# EAGLE design mainboard (EAGLE 7.2.0)
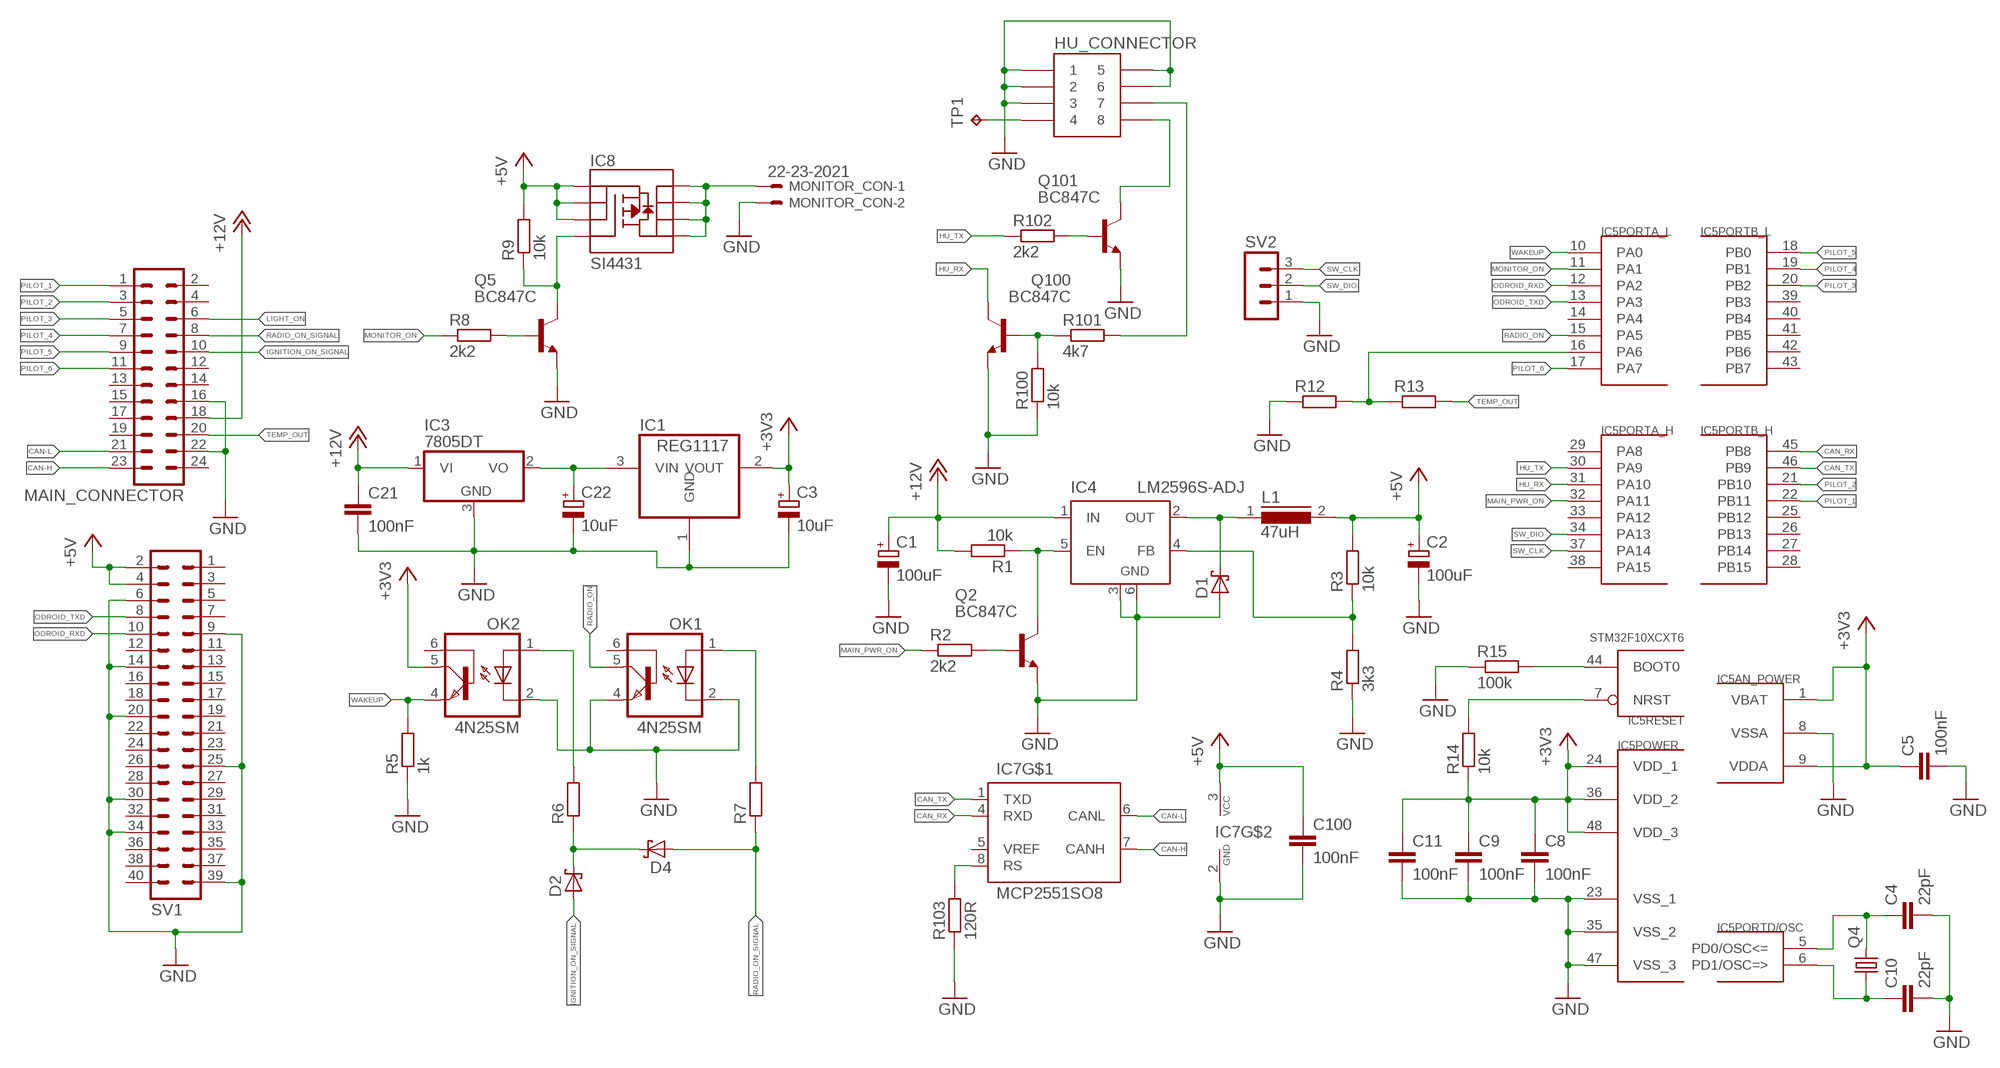
[diagram p0: schematic, sheet 1]

## Parts
C1  100uF  CPOL-EU153CLV-0807  [153CLV-0807]
C2  100uF  CPOL-EU153CLV-0807  [153CLV-0807]
C3  10uF  CPOL-EUSMCA  [SMC_A]
C4  22pF  C-EUC0805  [C0805]
C5  100nF  C-EUC0603  [C0603]
C8  100nF  C-EUC0805  [C0805]
C9  100nF  C-EUC0805  [C0805]
C10  22pF  C-EUC0805  [C0805]
C11  100nF  C-EUC0805  [C0805]
C21  100nF  C-EUC0805  [C0805]
C22  10uF  CPOL-EUSMCA  [SMC_A]
C100  100nF  C-EUC0805  [C0805]
D1  SCHOTTKY-DIODESMD  [SMB]
D2  SCHOTTKY-DIODESMD  [SMB]
D4  SCHOTTKY-DIODESMD  [SMB]
HU_CONNECTOR  MRX56908CV  [MRX56908]
IC1  REG1117  [SOT223]
IC3  7805DT  [TO252]
IC4  LM2596S-ADJ  LM2596S  [TO263-5]
IC5  STM32F10XCXT6  [TQFP48]
IC7  MCP2551SO8  [SO08]
IC8  SI4431  MOSFET-PCHANNEL-SOIC8SOIC8  [SO08]
L1  47uH  DR125  [DR125]
MAIN_CONNECTOR  MA12-2  [MA12-2]
MONITOR_CON  22-23-2021  [22-23-2021]
OK1  4N25SM  [DIL6-SMD]
OK2  4N25SM  [DIL6-SMD]
Q2  BC847C  BC847C-NPN-SOT23-BEC  [SOT23-BEC]
Q4  CRYSTALHC49UP  [HC49UP]
Q5  BC847C  BC847C-NPN-SOT23-BEC  [SOT23-BEC]
Q100  BC847C  BC847C-NPN-SOT23-BEC  [SOT23-BEC]
Q101  BC847C  BC847C-NPN-SOT23-BEC  [SOT23-BEC]
R1  10k  R-EU_M0805  [M0805]
R2  2k2  R-EU_M0805  [M0805]
R3  10k  R-EU_M0805  [M0805]
R4  3k3  R-EU_M0805  [M0805]
R5  1k  R-EU_M0805  [M0805]
R6  R-EU_M0805  [M0805]
R7  R-EU_M0805  [M0805]
R8  2k2  R-EU_M0805  [M0805]
R9  10k  R-EU_M0805  [M0805]
R12  R-EU_M0805  [M0805]
R13  R-EU_M0805  [M0805]
R14  10k  R-EU_M0805  [M0805]
R15  100k  R-EU_M0805  [M0805]
R100  10k  R-EU_M0805  [M0805]
R101  4k7  R-EU_M0805  [M0805]
R102  2k2  R-EU_M0805  [M0805]
R103  120R  R-EU_R0805  [R0805]
SV1  MA20-2  [MA20-2]
SV2  MA03-1  [MA03-1]
TP1  TPPAD1-13  [P1-13]

## Nets
+3V3: C3.+ C5.1 C8.1 C9.1 C11.1 IC1.2(VOUT) IC5.1(AN_POWER:VBAT) IC5.9(AN_POWER:VDDA) IC5.24(POWER:VDD_1) IC5.36(POWER:VDD_2) IC5.48(POWER:VDD_3) OK2.5(COL) R14.1
+5V [zasilanie]: C2.+ C100.1 IC7.3(VCC) IC8.1(S) IC8.2(S) IC8.3(S) L1.2 R3.2 R9.2 SV1.2 SV1.4
+5V_CONST [zasilanie]: C22.+ IC1.3(VIN) IC3.2(VO)
+12V: C1.+ C21.1 IC3.1(VI) IC4.1(IN) MAIN_CONNECTOR.18 R1.2
CAN-H: IC7.7(CANH) MAIN_CONNECTOR.23
CAN-L: IC7.6(CANL) MAIN_CONNECTOR.21
CAN_RX: IC5.45(PORTB_H:PB8) IC7.4(RXD)
CAN_TX: IC5.46(PORTB_H:PB9) IC7.1(TXD)
GND: C1.- C2.- C3.- C4.2 C5.2 C8.2 C9.2 C10.2 C11.2 C21.2 C22.- C100.2 D1.A HU_CONNECTOR.P1 HU_CONNECTOR.P2 HU_CONNECTOR.P3 HU_CONNECTOR.P5 HU_CONNECTOR.P6 IC1.1(GND) IC3.3(GND) IC4.3(GND) IC4.6(GND) IC5.8(AN_POWER:VSSA) IC5.23(POWER:VSS_1) IC5.35(POWER:VSS_2) IC5.47(POWER:VSS_3) IC7.2(GND) MAIN_CONNECTOR.16 MAIN_CONNECTOR.22 MONITOR_CON.2 OK1.2(C) OK1.4(EMI) OK2.2(C) Q2.E Q5.E Q100.E Q101.E R4.1 R5.1 R12.1 R15.1 R100.1 R103.1 SV1.6 SV1.9 SV1.14 SV1.20 SV1.25 SV1.30 SV1.34 SV1.39 SV2.1
HU_RX: IC5.31(PORTA_H:PA10) Q100.C
HU_TX: IC5.30(PORTA_H:PA9) R102.1
IGNITION_ON_SIGNAL: D2.A MAIN_CONNECTOR.10
LIGHT_ON: MAIN_CONNECTOR.6
MAIN_PWR_ON: IC5.32(PORTA_H:PA11) R2.1
MONITOR_ON: IC5.11(PORTA_L:PA1) R8.1
N$1: IC7.8(RS) R103.2
N$2: IC5.16(PORTA_L:PA6) R12.2 R13.1
N$3: C4.1 IC5.5(PORTD/OSC:PD0/OSC<=) Q4.2
N$8: D1.C IC4.2(OUT) L1.1
N$9: IC4.5(EN) Q2.C R1.1
N$10: Q2.B R2.2
N$12: IC4.4(FB) R3.1 R4.2
N$13: IC5.7(RESET:NRST) R14.2
N$14: IC8.5(D) IC8.6(D) IC8.7(D) IC8.8(D) MONITOR_CON.1
N$18: C10.1 IC5.6(PORTD/OSC:PD1/OSC=>) Q4.1
N$23: Q101.B R102.2
N$24: OK2.1(A) R6.2
N$25: OK1.1(A) R7.2
N$26: D2.C D4.C R6.1
N$27: IC5.44(RESET:BOOT0) R15.2
N$32: HU_CONNECTOR.P7 R101.2
N$33: Q100.B R100.2 R101.1
N$34: HU_CONNECTOR.P8 Q101.C
N$53: Q5.B R8.2
N$67: IC8.4(G) Q5.C R9.1
ODROID_RXD: IC5.12(PORTA_L:PA2) SV1.10
ODROID_TXD: IC5.13(PORTA_L:PA3) SV1.8
PILOT_1: IC5.22(PORTB_H:PB11) MAIN_CONNECTOR.1
PILOT_2: IC5.21(PORTB_H:PB10) MAIN_CONNECTOR.3
PILOT_3: IC5.20(PORTB_L:PB2) MAIN_CONNECTOR.5
PILOT_4: IC5.19(PORTB_L:PB1) MAIN_CONNECTOR.7
PILOT_5: IC5.18(PORTB_L:PB0) MAIN_CONNECTOR.9
PILOT_6: IC5.17(PORTA_L:PA7) MAIN_CONNECTOR.11
RADIO_ON: IC5.15(PORTA_L:PA5) OK1.5(COL)
RADIO_ON_SIGNAL: D4.A MAIN_CONNECTOR.8 R7.1
SPDIF_IN: HU_CONNECTOR.P4 TP1.TP
SW_CLK: IC5.37(PORTA_H:PA14) SV2.3
SW_DIO: IC5.34(PORTA_H:PA13) SV2.2
TEMP_OUT: MAIN_CONNECTOR.20 R13.2
WAKEUP: IC5.10(PORTA_L:PA0) OK2.4(EMI) R5.2
Unconnected: IC5.2(PORTC:PC13) IC5.3(PORTC:PC14) IC5.4(PORTC:PC15) IC5.14(PORTA_L:PA4) IC5.25(PORTB_H:PB12) IC5.26(PORTB_H:PB13) IC5.27(PORTB_H:PB14) IC5.28(PORTB_H:PB15) IC5.29(PORTA_H:PA8) IC5.33(PORTA_H:PA12) IC5.38(PORTA_H:PA15) IC5.39(PORTB_L:PB3) IC5.40(PORTB_L:PB4) IC5.41(PORTB_L:PB5) IC5.42(PORTB_L:PB6) IC5.43(PORTB_L:PB7) IC7.5(VREF) MAIN_CONNECTOR.2 MAIN_CONNECTOR.4 MAIN_CONNECTOR.12 MAIN_CONNECTOR.13 MAIN_CONNECTOR.14 MAIN_CONNECTOR.15 MAIN_CONNECTOR.17 MAIN_CONNECTOR.19 MAIN_CONNECTOR.24 OK1.6(BAS) OK2.6(BAS) SV1.1 SV1.3 SV1.5 SV1.7 SV1.11 SV1.12 SV1.13 SV1.15 SV1.16 SV1.17 SV1.18 SV1.19 SV1.21 SV1.22 SV1.23 SV1.24 SV1.26 SV1.27 SV1.28 SV1.29 SV1.31 SV1.32 SV1.33 SV1.35 SV1.36 SV1.37 SV1.38 SV1.40

## Library data of the parts
C1-C3 C22 = resistor:CPOL-EU: POLARIZED CAPACITOR, European symbol
C4 C5 C8-C11 C21 C100 = rcl:C-EU: CAPACITOR, European symbol
D1 D2 D4 = diode:SCHOTTKY-DIODE: Schottky Diode
HU_CONNECTOR = moja:MRX56908CV
IC1 = burr-brown:REG1117: 800mA and 1A Low Dropout (LDO) Positive Regulator 1.8V, 2.5V, 2.85V, 3.3V, 5V, and Adj; MPN: REG1117; OC_FARNELL: 1097566; OC_NEWARK: 14P6981
IC3 = linear:78*: Positive VOLTAGE REGULATOR Source: http://cache.national.com/ds/LM/LM78L05.pdf http://www.fairchildsemi.com/ds/LM/LM7805.pdf
IC4 = linear:LM2596S: STEP-DOWN VOLTAGE REGULATOR
IC5 = stm32:STM32F10XCXT6: ST STM32F101/103 48pin LQFP
IC7 = can:MCP2551: CAN Tranceiver Microchip
IC8 = SparkFun:MOSFET-PCHANNEL-SOIC8
L1 = inductors:DR125: High Power Density, High Efficiency, Shielded Inductors Source: coiltronics_dr_series.pdf
MAIN_CONNECTOR = con-lstb:MA12-2: PIN HEADER
MONITOR_CON = con-molex:22-23-2021: .100" (2.54mm) Center Header - 2 Pin
OK1 OK2 = optocoupler:4N*?M: General Purpose 6-Pin Phototransistor Optocouplers Source: http://www.fairchildsemi.com/ds/4N/4N35-M.pdf
Q2 Q5 Q100 Q101 = transistor:*-NPN-: NPN Transistror BF959 corrected 2008.03.06
Q4 = crystal:CRYSTAL: CRYSTAL; OC_FARNELL: unknown; OC_NEWARK: unknown
R1-R9 R12-R15 R100-R102 = rcl:R-EU_: RESISTOR, European symbol
R103 = resistor:R-EU_: RESISTOR, European symbol
SV1 = con-lstb:MA20-2: PIN HEADER; OC_FARNELL: unknown; OC_NEWARK: unknown
SV2 = con-lstb:MA03-1: PIN HEADER; OC_FARNELL: unknown; OC_NEWARK: unknown
TP1 = testpad:TP: Test pad

## Net classes
1 zasilanie: clearance 1.5 mm

## Board
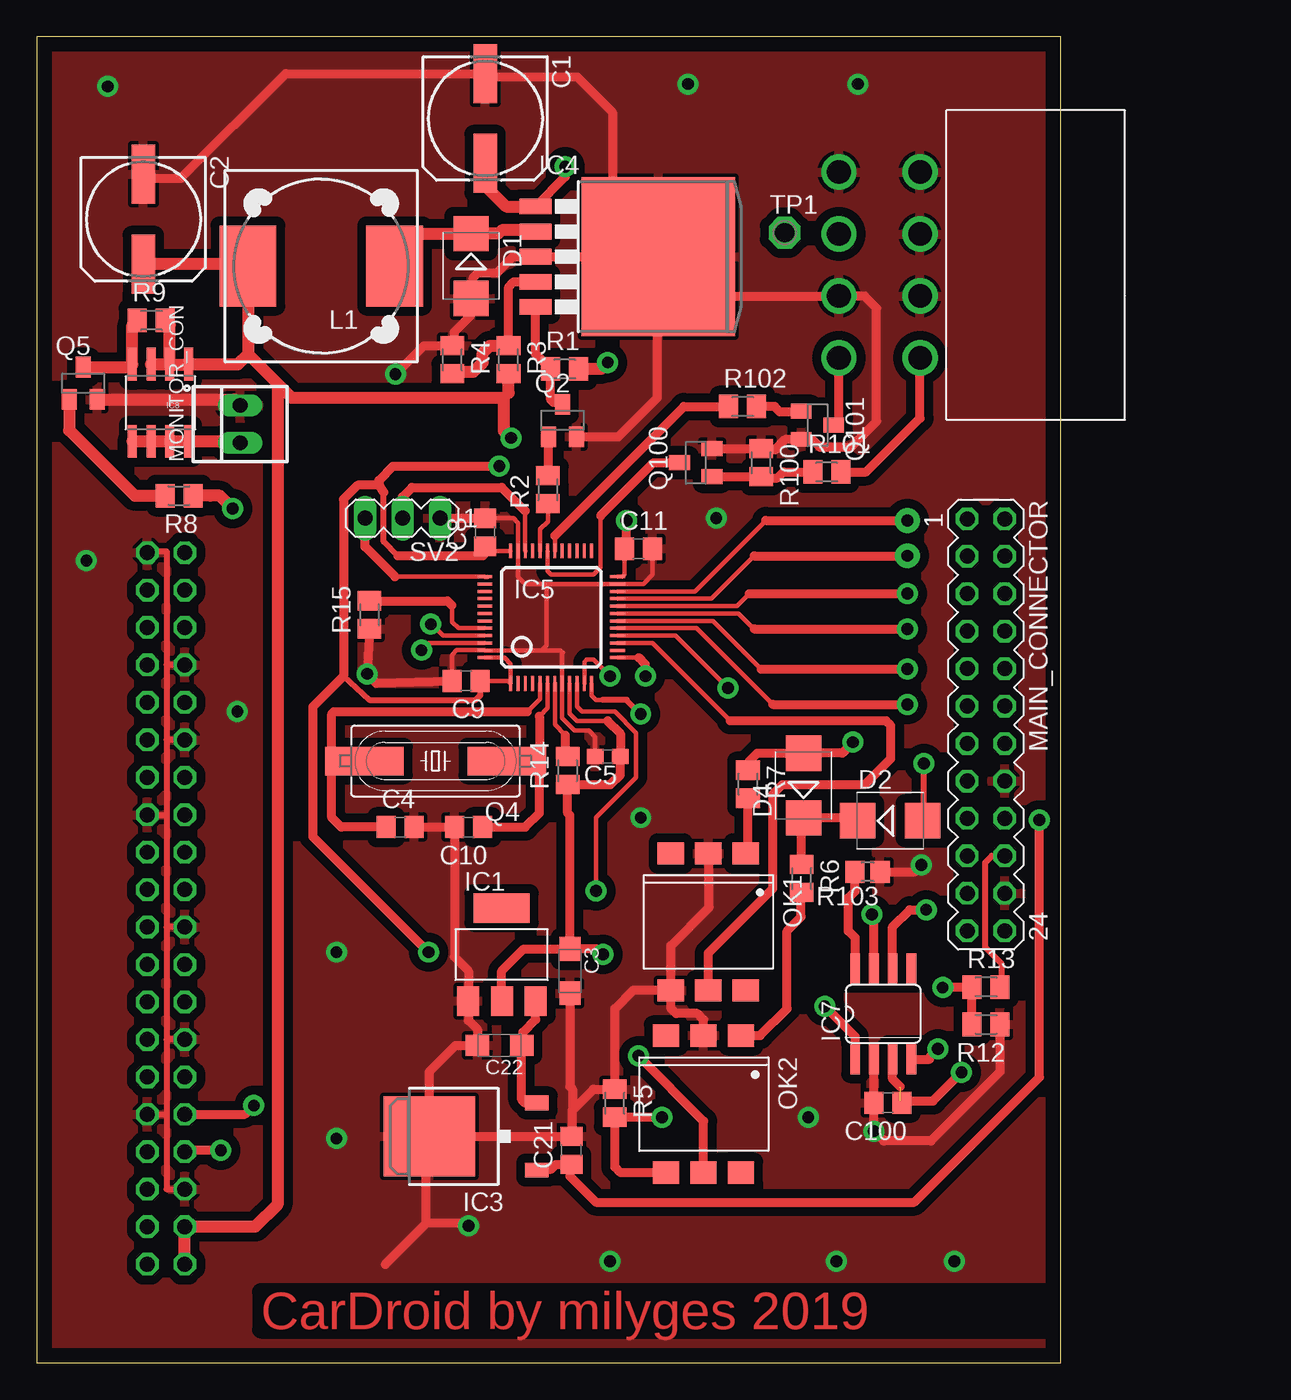
[diagram p1: board, top side]
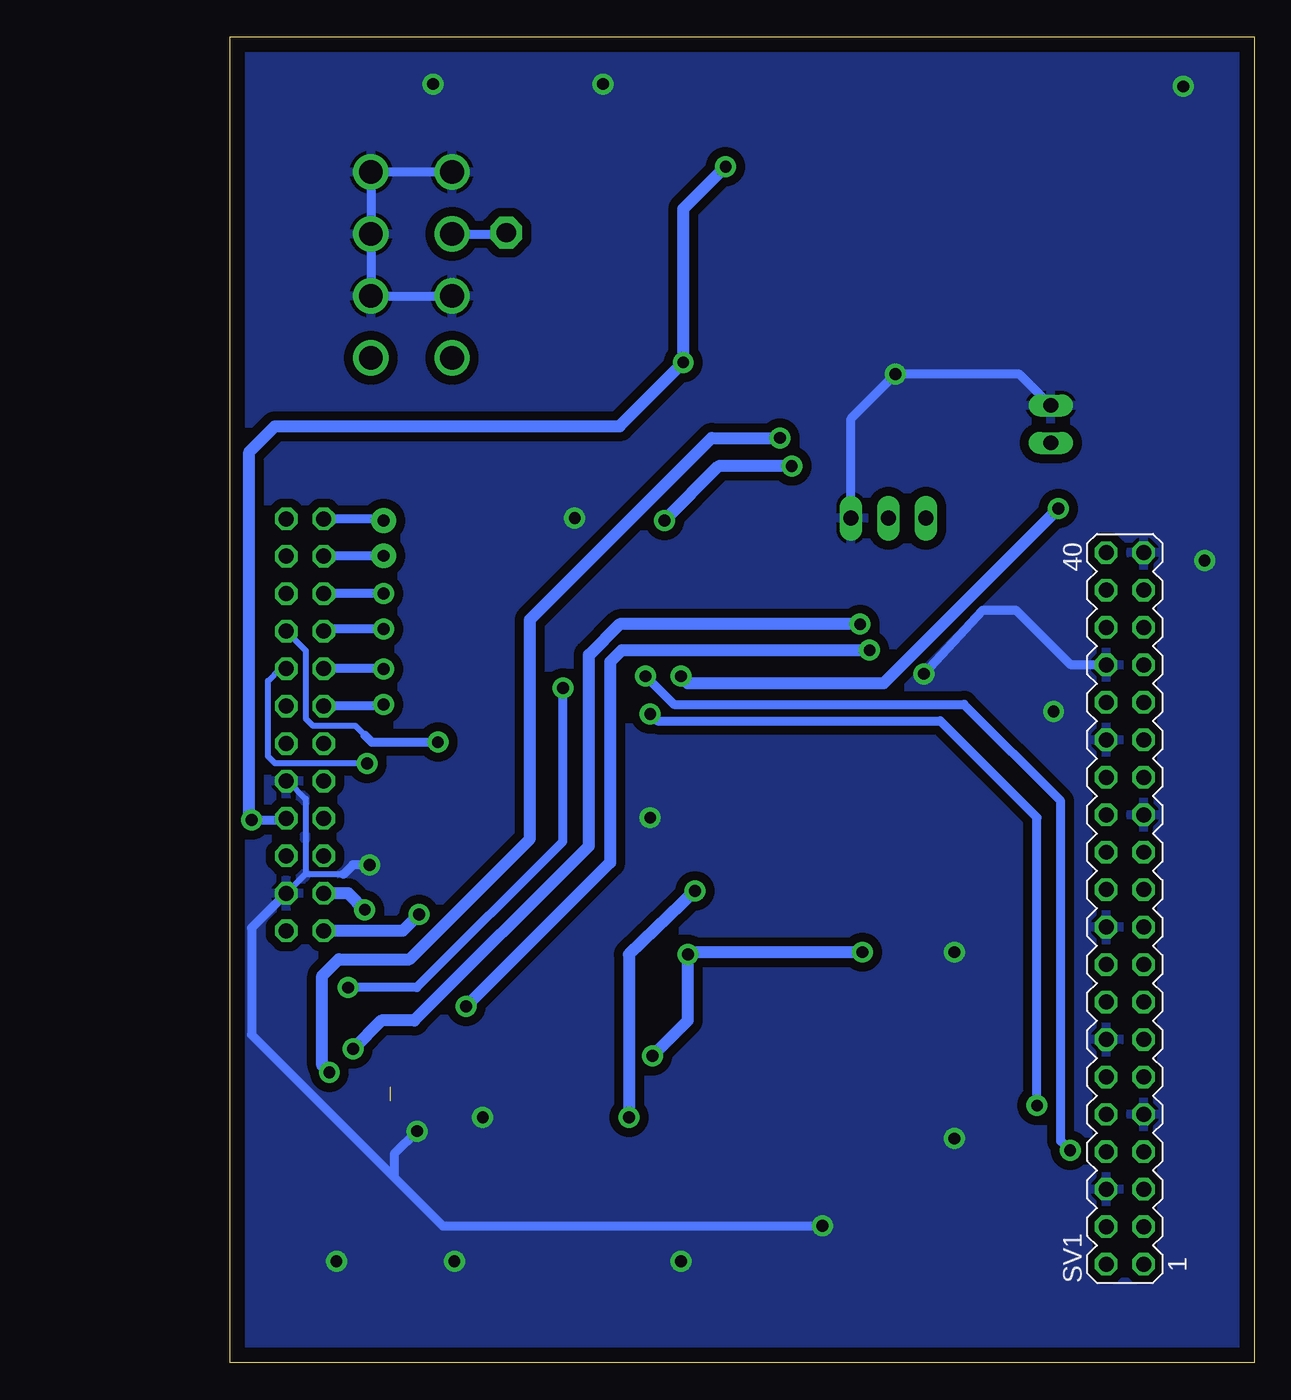
[diagram p2: board, bottom side, seen from below]

Size 69.44 x 89.92 mm. Coordinates in mm from the lower left corner, seen from the top.
Outline: 69.44,0 69.44,89.92 0,89.92 0,0 69.44,0
Copper layers (1*16): Top 0.035mm / dielectric 1.5mm / Bottom 0.035mm
Design rules "default": minimum track width 10mil, minimum drill 24mil, track to track 8mil, track to pad 8mil, pad to pad 8mil, via to via 8mil, smd to smd 8mil, copper to edge 40mil, drill to drill 8mil, minimum pad ring 10mil, minimum via ring 8mil, stop-mask expansion 4mil, vias tented up to drill 0mil, thermal gap 10mil

### Footprints (pad centres in the part's own frame; a part is rotated, then mirrored left to right if it is on the bottom)
153CLV-0807 = smd 4 x 1.6: + 3.05,0; - -3.05,0
SMC_A = smd 1.6 x 1.4: + -1.5,0; - 1.5,0
C0805 = smd 1.3 x 1.5: 1 -0.95,0; 2 0.95,0
C0603 = smd 1.1 x 1: 1 -0.85,0; 2 0.85,0
SMB = smd 2.4 x 2.4: A 2.2,0; C -2.2,0
MRX56908 = drill 1.6: P1 8.4,0; P2 8.4,5.5; P3 4.2,0; P4 4.2,5.5; P5 0,0; P6 0,5.5; P7 -4.2,0; P8 -4.2,5.5
SOT223 = smd 1.499 x 2.007: 1 -2.261,-3.15; 2 0.025,-3.15; 3 2.311,-3.15 | smd 3.81 x 2.007: 4 0,3.15
TO252 = smd 1 x 1.6: 1 -2.28,-4.8; 2 2.28,-4.8 | smd 5.4 x 6.2: 3 0,2.5
TO263-5 = smd 1.067 x 2.159: 1 -3.404,-5.791; 2 -1.702,-5.791; 3 0,-5.791; 4 1.702,-5.791; 5 3.404,-5.791 | smd 10.8 x 10.41: 6 0,2.54
TQFP48 = smd 0.2 x 1: 1 -2.75,-4.5; 2 -2.25,-4.5; 3 -1.75,-4.5; 4 -1.25,-4.5; 5 -0.75,-4.5; 6 -0.25,-4.5; 7 0.25,-4.5; 8 0.75,-4.5; 9 1.25,-4.5; 10 1.75,-4.5; 11 2.25,-4.5; 12 2.75,-4.5; 25 2.75,4.5; 26 2.25,4.5; 27 1.75,4.5; 28 1.25,4.5; 29 0.75,4.5; 30 0.25,4.5; 31 -0.25,4.5; 32 -0.75,4.5; 33 -1.25,4.5; 34 -1.75,4.5; 35 -2.25,4.5; 36 -2.75,4.5 | smd 1 x 0.2: 13 4.5,-2.75; 14 4.5,-2.25; 15 4.5,-1.75; 16 4.5,-1.25; 17 4.5,-0.75; 18 4.5,-0.25; 19 4.5,0.25; 20 4.5,0.75; 21 4.5,1.25; 22 4.5,1.75; 23 4.5,2.25; 24 4.5,2.75; 37 -4.5,2.75; 38 -4.5,2.25; 39 -4.5,1.75; 40 -4.5,1.25; 41 -4.5,0.75; 42 -4.5,0.25; 43 -4.5,-0.25; 44 -4.5,-0.75; 45 -4.5,-1.25; 46 -4.5,-1.75; 47 -4.5,-2.25; 48 -4.5,-2.75
SO08 = smd 0.66 x 2.032: 1 -1.905,-3.073; 2 -0.635,-3.073; 3 0.635,-3.073; 4 1.905,-3.073; 5 1.905,3.073; 6 0.635,3.073; 7 -0.635,3.073; 8 -1.905,3.073
SO08' = smd 0.61 x 2.21: 1 -1.905,-2.616; 2 -0.635,-2.616; 3 0.635,-2.616; 4 1.905,-2.616; 5 1.905,2.616; 6 0.635,2.616; 7 -0.635,2.616; 8 -1.905,2.616
DR125 = smd 3.85 x 5.5: 1 -4.975,0; 2 4.975,0
MA12-2 = drill 1.016 octagon: 1 -13.97,-1.27; 2 -13.97,1.27; 3 -11.43,-1.27; 4 -11.43,1.27; 5 -8.89,-1.27; 6 -8.89,1.27; 7 -6.35,-1.27; 8 -6.35,1.27; 9 -3.81,-1.27; 10 -3.81,1.27; 11 -1.27,-1.27; 12 -1.27,1.27; 13 1.27,-1.27; 14 1.27,1.27; 15 3.81,-1.27; 16 3.81,1.27; 17 6.35,-1.27; 18 6.35,1.27; 19 8.89,-1.27; 20 8.89,1.27; 21 11.43,-1.27; 22 11.43,1.27; 23 13.97,-1.27; 24 13.97,1.27
22-23-2021 = drill 1 long: 1 -1.27,0; 2 1.27,0
DIL6-SMD = smd 1.78 x 1.52: 1 -2.54,-4.645; 2 0,-4.645; 3 2.54,-4.645; 4 2.54,4.645; 5 0,4.645; 6 -2.54,4.645
SOT23-BEC = smd 1 x 1.4: B -0.95,-1.1; C 0,1.1; E 0.95,-1.1
HC49UP = smd 5.334 x 1.93: 1 -4.826,0; 2 4.826,0
M0805 = smd 1.3 x 1.6: 1 -0.95,0; 2 0.95,0
R0805 = smd 1.3 x 1.5: 1 -0.85,0; 2 0.85,0
MA20-2 = drill 1.016 octagon: 1 -24.13,-1.27; 2 -24.13,1.27; 3 -21.59,-1.27; 4 -21.59,1.27; 5 -19.05,-1.27; 6 -19.05,1.27; 7 -16.51,-1.27; 8 -16.51,1.27; 9 -13.97,-1.27; 10 -13.97,1.27; 11 -11.43,-1.27; 12 -11.43,1.27; 13 -8.89,-1.27; 14 -8.89,1.27; 15 -6.35,-1.27; 16 -6.35,1.27; 17 -3.81,-1.27; 18 -3.81,1.27; 19 -1.27,-1.27; 20 -1.27,1.27; 21 1.27,-1.27; 22 1.27,1.27; 23 3.81,-1.27; 24 3.81,1.27; 25 6.35,-1.27; 26 6.35,1.27; 27 8.89,-1.27; 28 8.89,1.27; 29 11.43,-1.27; 30 11.43,1.27; 31 13.97,-1.27; 32 13.97,1.27; 33 16.51,-1.27; 34 16.51,1.27; 35 19.05,-1.27; 36 19.05,1.27; 37 21.59,-1.27; 38 21.59,1.27; 39 24.13,-1.27; 40 24.13,1.27
MA03-1 = drill 1.016 long: 1 -2.54,0; 2 0,0; 3 2.54,0
P1-13 = drill 1.321 pad 2.159 octagon: TP 0,0

### Placement (x,y rotation side)
C1  30.41,84.39 270 top
C2  7.22,77.55 270 top
C3  36.16,26.56 270 top
C4  24.64,36.32 0 top
C5  38.72,41.12 180 top
C8  30.4,56.32 90 top
C9  29.12,46.24 180 top
C10  29.28,36.32 180 top
C11  40.8,55.2 0 top
C21  36.26,14.39 90 top
C22  31.39,21.52 180 top
C100  57.73,17.62 180 top
D1  29.45,74.38 270 top
D2  57.88,36.75 0 top
D4  52,39.14 90 top
HU_CONNECTOR  59.9,72.34 90 top
IC1  31.52,27.68 0 top
IC3  29.11,15.35 90 top
IC4  39.61,75.01 270 top
IC5  34.88,50.56 0 top
IC7  57.41,23.66 0 top
IC8  SI4431  [SO08']  8.38,65.11 180 top
L1  19.29,74.38 180 top
MAIN_CONNECTOR  64.38,43.26 270 top
MONITOR_CON  13.79,63.65 90 top
OK1  45.54,29.89 180 top
OK2  45.22,17.54 180 top
Q2  35.65,63.89 0 top
Q4  27.04,40.8 180 top
Q5  3.15,66.42 0 top
Q100  44.69,61.04 90 top
Q101  52.95,63.58 270 top
R1  35.8,67.39 0 top
R2  34.66,59.2 90 top
R3  31.99,68.03 270 top
R4  28.18,68.03 270 top
R5  39.2,17.6 270 top
R6  51.88,32.84 270 top
R7  48.23,39.23 270 top
R8  9.64,58.8 180 top
R9  7.76,70.69 0 top
R12  64.38,22.94 180 top
R13  64.38,25.48 0 top
R14  36,40.16 90 top
R15  22.56,50.72 90 top
R100  49.14,61.04 270 top
R101  53.58,60.41 0 top
R102  47.87,64.85 0 top
R103  56.35,33.29 180 top
SV1  8.76,30.81 90 bottom
SV2  24.8,57.28 180 top
TP1  50.72,76.64 0 top

### Tracks (layer width: path | path; a pad name or v marks a point on that pad's centre or on a via)
+3V3  (via drill 0.8 pad 1.42)
  Top 0.305: IC5.48 31.71,47.81 32.13,47.39 IC5.1 31.95,46.24 C9.1 | IC5.24 39.71,53.31 39.85,53.45 C11.1 | C8.1 30.55,55.52 31.01,55.06 IC5.36 | IC5.9 36.13,44.03 36.64,43.52 38.72,43.52
  Top 0.406: 30.55,55.52 30.55,55.03 | 24.48,54.72 23.52,55.68 23.52,59.04 | C9.1 30.08,45.28 29.76,44.96 22.56,44.96 20.8,46.56
  Top 0.61: 38.72,43.52 39.57,42.67 C5.1 39.57,39.89 38.88,39.2 R14.1 36,37.28 36.16,37.12 C3.+ | IC1.2 31.52,24.56 31.52,26.56 33.02,28.06 C3.+ | 30.55,55.03 30.24,54.72 24.48,54.72 | 23.52,59.04 23.2,59.52 | 23.2,59.52 21.76,59.52 20.8,58.56 20.8,46.56 18.72,44.48 18.72,35.68 v26.56,27.84 | OK2.5 45.22,16.38 v40.8,20.8 | v38.4,27.68 38.02,28.06 C3.+ | C11.1 40,55.35 v40,57.12 | 23.2,59.52 23.2,59.84 24.16,60.8 v31.36,60.8
  Bottom 0.61: 38.24,27.84 v38.4,27.68
  Bottom 0.813: v40.8,20.8 38.4,23.2 v38.4,27.68 | v26.56,27.84 38.24,27.84 | v40,57.12 36.32,60.8 v31.36,60.8
+5V  (via drill 0.8 pad 1.42)  (1 unrouted)
  Top 0.61: L1.2 14.19,74.5 | 31.68,65.44 32,65.76 | R3.2 | C100.1 58.56,17.74 60.79,17.74 v62.72,19.68 | 58.56,18.72 58.05,19.23 IC7.3 | IC8.2 9.08,67.72 9.12,67.68 | 10.24,67.68 IC8.1
  Top 0.813: 14.19,74.5 C2.+ | L1.2 14.31,68.41 | 14.31,68.41 16.32,66.4 | 16.32,66.4 17.28,65.44 31.68,65.44 31.68,63.2 v32.16,62.72 | 32,65.76 R3.2 | IC8.3 IC8.2 9.02,70.39 R9.2 | 9.12,67.68 10.24,67.68 | IC8.1 13.63,67.72 14.31,68.41 | 16.32,66.4 16.32,10.72 14.82,9.22 SV1.4 SV1.2
  Bottom 0.813: v62.72,19.68 63.2,20.16 63.2,26.24 62.08,27.36 57.28,27.36 49.12,35.52 49.12,50.4 36.8,62.72 v32.16,62.72
+5V_CONST
  Top 0.61: IC1.3 33.83,23.27 32.96,22.4 32.96,21.59 C22.+ 32.89,17.84 33.12,17.6 33.89,17.6 IC3.2
+12V  (via drill 0.8 pad 1.42)
  Top 0.61: IC4.1 35.84,80.44 v35.84,81.12 | IC3.1 33.97,13.12 34.88,13.12 35.21,13.45 C21.1 36.16,13.35 36.16,12.64 37.92,10.88 59.52,10.88 68,19.36 v68,36.8 | 30.41,79.83 C1.+
  Top 0.813: IC4.1 31.83,78.41 30.41,79.83 | v38.72,67.84 38.27,67.39 R1.2
  Bottom 0.61: MAIN_CONNECTOR.18 65.76,36.8 v68,36.8 68.16,36.96
  Bottom 0.813: v35.84,81.12 38.72,78.24 v38.72,67.84 43.04,63.52 66.4,63.52 68.16,61.76 68.16,36.96
CAN-H  (via drill 0.8 pad 1.42)
  Top 0.61: IC7.7 56.78,30.27 v56.64,30.4
  Bottom 0.813: v56.64,30.4 57.75,29.29 MAIN_CONNECTOR.23
CAN-L  (via drill 0.8 pad 1.42)
  Top 0.61: IC7.6 58.05,29.57 59.2,30.72 v60.32,30.72
  Bottom 0.61: MAIN_CONNECTOR.21
  Bottom 0.813: v60.32,30.72 61.43,31.83 MAIN_CONNECTOR.21
CAN_RX  (via drill 0.8 pad 1.42)
  Top 0.305: IC5.45 27.55,49.31 26.78,50.08 v26.72,50.08
  Top 0.61: IC7.4 60.54,20.58 60.54,20.7 v61.12,21.28
  Bottom 0.813: v26.72,50.08 43.04,50.08 45.12,48 45.12,35.04 56.96,23.2 59.2,23.2 v61.12,21.28
CAN_TX  (via drill 0.8 pad 1.42)
  Top 0.305: IC5.46 26.57,48.81 v26.08,48.32
  Top 0.61: IC7.1 55.51,22.09 v53.44,24.16
  Bottom 0.813: v26.08,48.32 42.88,48.32 43.68,47.52 43.68,33.92 v53.44,24.16
GND  (via drill 0.8 pad 1.42)
  Top 0.305: 34.4,52.81 IC5.23 41.13,52.81 41.76,53.44 C11.2 | 34.4,52.81 33.11,52.81 32.64,53.28 IC5.35 32.64,56.96 32.33,57.27 C8.2 | 34.23,48.31 IC5.47 28.48,48.32 28.17,48.01 C9.2 | 34.23,48.31 34.56,48.64 34.56,52.65 34.4,52.81 | 34.23,48.31 35.53,48.31 35.68,48.16 35.63,48.11 IC5.8 35.63,43.73 36.48,42.88 37.44,42.88 37.87,42.45 C5.2
  Top 0.406: SV1.39 7.49,55.04 8.8,55.04 8.8,47.32 | 8.8,47.32 8.8,42.24 | 8.8,42.24 8.8,37.16 | 8.8,37.16 8.8,29.54 | 8.8,29.54 8.8,21.92 | 8.8,21.92 8.8,16.84 | 8.8,16.84 8.8,11.76 SV1.6 | SV1.9 8.8,16.84 | SV1.14 8.8,21.92 | SV1.20 8.8,29.54 | SV1.25 8.8,37.16 | SV1.30 8.8,42.24 | SV1.34 8.8,47.32
  Top 0.61: C4.2 C10.2 28.32,27.52 29.28,26.56 29.28,24.55 IC1.1 29.28,24.51 29.28,23.2 29.89,22.59 C22.- 28.39,21.52 26.61,19.73 IC3.3 | 40.16,75.01 IC4.3 32.29,75.01 31.2,73.92 29.92,73.92 29.6,73.6 29.6,72.33 D1.A 29.45,71.05 28.32,69.92 28.32,69.12 R4.1 26.25,68.98 v24.32,67.04 | 40.16,75.01 IC4.6 | 40.16,75.01 40.16,77.44 39.04,78.56 39.04,84.8 36.64,87.2 30.64,87.2 C1.- 16.88,87.44 9.76,80.32 7.5,80.32 C2.- | Q2.E 39.44,62.8 42.08,65.44 42.08,74.94 44.68,72.34 HU_CONNECTOR.P6 56.14,72.34 56.96,71.52 56.96,63.84 55.2,62.08 53.12,62.08 52.64,62.56 51.92,62.56 Q101.E 50.79,62.63 50.08,61.92 49.21,61.92 R100.1 Q100.E | IC7.2 C100.2 v56.78,15.7 57.44,15.04 60.64,15.04 65.33,19.73 R12.1 | OK1.4 43,28.28 45.6,30.88 45.6,34.48 OK1.2 | OK2.2 45.22,23.26 44.8,23.68 43.36,23.68 43,24.04 OK1.4 | OK1.4 42.97,25.28 40.48,25.28 39.2,24 R5.1 37.75,18.55 36.32,17.12 | R103.1 59.53,33.29 v60,33.76 | 36.32,17.12 36.32,15.41 C21.2 IC3.3 | C3.- 36.16,18.72 36.32,18.56 36.32,17.12 | R15.1 v22.4,46.72 23.04,46.08 C9.2 | 23.62,6.66 26.4,9.44 | 26.4,9.44 26.4,15.13 IC3.3 | SV2.1 C8.2 | v29.28,9.28 29.12,9.44 26.4,9.44
  Top 0.813: Q5.E 13.38,65.33 MONITOR_CON.2
  Bottom 0.406: 61.76,33.12 64.36,33.12 | 64.36,33.12 MAIN_CONNECTOR.22 | MAIN_CONNECTOR.16 65.53,39.45 64.32,38.24 64.32,33.16 64.36,33.12
  Bottom 0.61: HU_CONNECTOR.P2 HU_CONNECTOR.P1 HU_CONNECTOR.P3 HU_CONNECTOR.P5 HU_CONNECTOR.P6 | v60,33.76 61.12,33.76 61.76,33.12 | MONITOR_CON.2 15.91,67.04 v24.32,67.04 27.34,64.02 SV2.1 | MAIN_CONNECTOR.22 68,29.48 68,22.24 58.32,12.56 | 58.32,12.56 55.04,9.28 v29.28,9.28 | v56.78,15.7 58.32,14.16 58.32,12.56 | v22.4,46.72 18.4,51.04 16.16,51.04 12.48,47.36 10.07,47.36 SV1.34
  other vias: 4.8,86.56 44.16,86.72 55.68,86.72 3.36,54.4 62.24,6.88 20.32,15.2 13.6,44.16 38.88,6.88 54.24,6.88 52.32,16.64 40.96,36.96 20.32,27.84 46.08,57.28
  pour Bottom (isolate 0.61): 0,0.16 69.44,0.16 69.44,89.92 0,89.92
  pour Top (isolate 0.61): 0,0 69.44,0 69.44,89.92 0,89.92
HU_RX
  Top 0.305: IC5.31 34.63,53.69 34.88,53.44 37.76,53.44 38.24,53.92 38.24,57.44
  Top 0.61: 38.24,57.44 41.84,61.04 Q100.C
HU_TX
  Top 0.305: IC5.30 35.13,56.09
  Top 0.61: 35.13,56.09 43.89,64.85 R102.1
IGNITION_ON_SIGNAL  (via drill 0.8 pad 1.42)
  Top 0.406: D2.A 60.16,36.84 v60.16,40.64
  Bottom 0.406: v60.16,40.64 66.4,40.64 66.88,41.12 66.88,46.24 66.05,47.07 MAIN_CONNECTOR.10
MAIN_PWR_ON
  Top 0.305: IC5.32 34.13,56.53 34.66,57.06 R2.1
MONITOR_ON  (via drill 0.8 pad 1.42)
  Top 0.305: IC5.11 37.13,47.53 37.28,47.68 37.76,47.68 v38.88,46.56
  Top 0.813: R8.1 11.76,58.8 12.4,58.8 v13.28,57.92
  Bottom 0.813: v38.88,46.56 38.4,46.08 25.12,46.08 v13.28,57.92
N$1
  Top 0.61: IC7.8 55.51,28.82 55.04,29.28 55.04,31.52 55.5,31.98 R103.2
N$2  (via drill 0.8 pad 1.42)
  Top 0.305: IC5.16 43.33,49.31 v46.88,45.76
  Top 0.61: R12.2 R13.1 61.48,25.48 v61.44,25.44
  Bottom 0.61: v61.44,25.44 56.8,25.44 46.88,35.36 v46.88,45.76
N$3
  Top 0.305: Q4.2 20.64,40.8 20,41.44 | 33.28,44.16 34.13,45.01 IC5.5
  Top 0.61: 20,41.44 20,44 20.16,44.16 33.28,44.16 | C4.1 20.64,36.32 20,36.96 20,40.16 20.64,40.8
N$8
  Top 0.61: IC4.2 33.73,76.8 | 31.52,76.8 31.29,76.58 | L1.1 24.48,74.59 24.48,75.36 25.7,76.58
  Top 0.813: 33.73,76.8 31.52,76.8 | 31.29,76.58 D1.C 25.7,76.58
N$9
  Top 0.61: Q2.C 35.53,65.12 35.04,65.12 34.85,65.31 R1.1 33.82,68.42 IC4.5
N$10
  Top 0.61: R2.2 34.7,60.2 Q2.B
N$12
  Top 0.61: R3.1 32,72.96 32.35,73.31 IC4.4 | R4.2 28.3,67.2
  Top 0.813: 28.3,67.2 29.6,67.2 30.24,67.84 30.24,68.48 30.73,68.98 R3.1
N$13
  Top 0.305: IC5.7 35.13,43.27 35.84,42.56 | 35.84,41.27 R14.2
  Top 0.61: 35.84,42.56 35.84,41.27
N$14
  Top 0.813: IC8.5 IC8.6 IC8.7 IC8.8 13.68,62.49 MONITOR_CON.1
N$18
  Top 0.305: IC5.6 34.63,44.39 34.08,43.84 | 34.08,40.8 Q4.1
  Top 0.61: 34.08,43.84 34.08,40.8 34.08,37.28 33.12,36.32 C10.1
N$23
  Top 0.61: Q101.B 51.8,64.48 50.4,64.48 50.03,64.85 R102.2
N$24
  Top 0.61: OK2.1 49.06,22.18 50.88,24 50.88,29.28 51.84,30.24 51.84,31.85 R6.2
N$25
  Top 0.61: OK1.1 48.23,34.69 R7.2
N$26
  Top 0.61: D2.C 55.49,36.94 D4.C 51.88,36.82 R6.1
N$27
  Top 0.305: 28.16,51.36 28.16,50.24 28.59,49.81 IC5.44
  Top 0.61: R15.2 27.85,51.67 28.16,51.36
N$32
  Top 0.61: R101.2 56.25,60.41 59.9,64.06 HU_CONNECTOR.P7
N$33
  Top 0.61: R101.1 50.65,60.41 50.24,60 49.23,60 R100.2 Q100.B
N$34
  Top 0.61: Q101.C 54.4,63.94 HU_CONNECTOR.P8
N$53
  Top 0.813: Q5.B 2.19,63.25 6.64,58.8 R8.2
N$67
  Top 0.813: Q5.C 6.28,67.53 IC8.4 6.47,70.36 R9.1
ODROID_RXD  (via drill 0.8 pad 1.42)
  Top 0.305: 38.4,44.96 37.92,44.96 37.63,45.25 IC5.12
  Top 0.406: v40.96,44 40,44.96 38.4,44.96
  Top 0.61: SV1.10 14.12,16.84 v14.72,17.44
  Bottom 0.61: v40.96,44 40.48,43.52 21.28,43.52 14.72,36.96 v14.72,17.44
ODROID_TXD  (via drill 0.8 pad 1.42)
  Top 0.305: 40.83,47.81 IC5.13
  Top 0.61: v41.28,46.56 41.28,47.36 40.83,47.81 | v12.48,14.4 10.13,14.4 SV1.8
  Bottom 0.61: v41.28,46.56 39.36,44.64 19.68,44.64 13.12,38.08 13.12,15.04 v12.48,14.4
PILOT_1  (via drill 0.8 pad 1.68)
  Top 0.305: IC5.22 44.63,52.31 49.44,57.12
  Top 0.61: 49.44,57.12 v59.04,57.12
  Bottom 0.61: v59.04,57.12 59.15,57.23 MAIN_CONNECTOR.1
PILOT_2  (via drill 0.8 pad 1.68)
  Top 0.305: 48.64,54.72 45.76,51.84 45.73,51.81 IC5.21
  Top 0.61: 48.64,54.72 v59.04,54.72
  Bottom 0.61: v59.04,54.72 59.07,54.69 MAIN_CONNECTOR.3
PILOT_3  (via drill 0.8 pad 1.42)
  Top 0.305: IC5.20 47.47,51.31 48.32,52.16
  Top 0.61: 48.32,52.16 v59.04,52.16
  Bottom 0.61: v59.04,52.16 v59.05,52.15 MAIN_CONNECTOR.5
PILOT_4  (via drill 0.8 pad 1.42)
  Top 0.305: IC5.19 47.59,50.81 48.64,49.76
  Top 0.61: 48.64,49.76 v59.04,49.76
  Bottom 0.61: v59.04,49.76 62.96,49.76 MAIN_CONNECTOR.7
PILOT_5  (via drill 0.8 pad 1.42)
  Top 0.305: IC5.18 45.85,50.31 49.12,47.04
  Top 0.61: 49.12,47.04 v59.04,47.04
  Bottom 0.61: v59.04,47.04 59.07,47.07 MAIN_CONNECTOR.9
PILOT_6  (via drill 0.8 pad 1.42)
  Top 0.305: IC5.17 44.75,49.81 49.92,44.64
  Top 0.61: 49.92,44.64 v59.04,44.64
  Bottom 0.61: v59.04,44.64 59.15,44.53 MAIN_CONNECTOR.11
RADIO_ON
  Top 0.305: 47.04,43.52 41.75,48.81 IC5.15
  Top 0.61: OK1.5 45.54,27.78 49.92,32.16 49.92,38.56 50.56,39.2 56.16,39.2 57.92,40.96 57.92,43.2 57.6,43.52 47.04,43.52
RADIO_ON_SIGNAL  (via drill 0.8 pad 1.42)
  Top 0.406: 54.79,41.34 D4.A
  Top 0.61: R7.1 48.32,40.28 48.32,40.8 48.87,41.34 D4.A 54.62,41.34 v55.36,42.08
  Bottom 0.406: MAIN_CONNECTOR.8 64.32,48.28 64.32,43.68 63.84,43.2 60.96,43.2 60.32,42.56
  Bottom 0.61: 60.32,42.56 59.84,42.08 v55.36,42.08
SPDIF_IN
  Bottom 0.61: HU_CONNECTOR.P4 50.82,76.55 TP1.TP
SW_CLK
  Top 0.305: 30.56,53.28 30.41,53.28 IC5.37 24.29,53.31
  Top 0.61: 24.29,53.31 22.26,55.34 SV2.3
SW_DIO
  Top 0.305: 33.12,57.76 IC5.34
  Top 0.61: SV2.2 24.8,58.72 25.44,59.36 31.52,59.36 33.12,57.76
TEMP_OUT
  Top 0.406: R13.2 65.44,25.59 65.44,27.04 64.32,28.16 64.32,33.92 64.77,34.37 MAIN_CONNECTOR.20
WAKEUP  (via drill 0.8 pad 1.42)
  Top 0.305: IC5.10 36.63,44.49 36.96,44.16 39.2,44.16 40.64,42.72 40.64,39.68 37.92,36.96 v37.92,32
  Top 0.61: OK2.4 39.59,12.89 39.2,13.28 R5.2 41.75,16.65 v42.4,16.64
  Bottom 0.813: v37.92,32 42.4,27.68 v42.4,16.64

### Text on the board
Top: CarDroid by milyges 2019